# Altium schematic sheet Part25_Button_LED.SchDoc
size A4
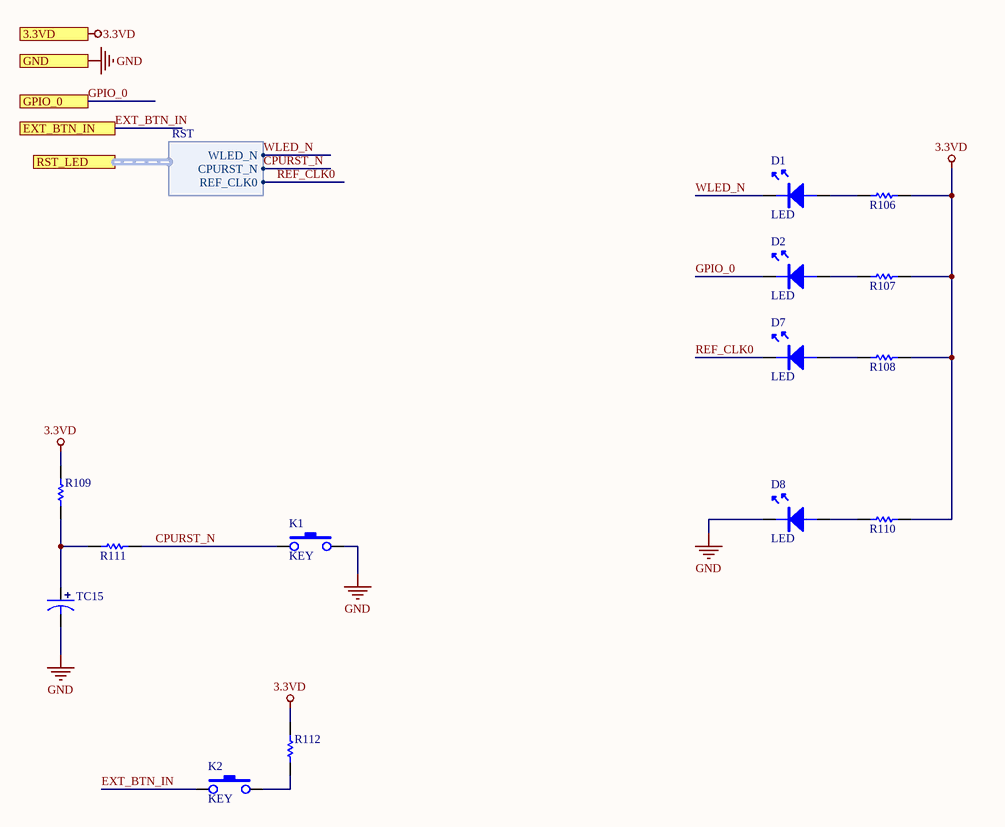
[diagram p0: Part25_Button_LED.SchDoc]

## Parts
D1  LED  [LED-0603B]
D2  LED  [LED-0603B]
D7  LED  [LED-0603B]
D8  LED  [LED-0603B]
K1  KEY  [SMD-6X6X4.3]
K2  KEY  [SMD-6X6X4.3]
R106  RES  [0402R]  (value not drawn)
R107  RES  [0402R]  (value not drawn)
R108  RES  [0402R]  (value not drawn)
R109  RES  [0402R]  (value not drawn)
R110  RES  [0402R]  (value not drawn)
R111  RES  [0402R]  (value not drawn)
R112  RES  [0402R]  (value not drawn)
TC15  4.7uF/6.3V  [TAJ-A/3216]  (value not drawn)

## Ports
3.3VD, EXT_BTN_IN, GND, GPIO_0, RST_LED (harness RST)

## Harnesses
RST: WLED_N, CPURST_N, REF_CLK0

## Nets
3.3VD: R106.2 R107.2 R108.2 R109.1 R110.2 R112.1 ; port 3.3VD
GND: D8.K K1.3 TC15.2 ; port GND
CPURST_N: K1.1 R111.2 ; port RST_LED.CPURST_N
EXT_BTN_IN: K2.1 ; port EXT_BTN_IN
GPIO_0: D2.K ; port GPIO_0
REF_CLK0: D7.K ; port RST_LED.REF_CLK0
WLED_N: D1.K ; port RST_LED.WLED_N
NetD1_A: D1.A R106.1
NetD2_A: D2.A R107.1
NetD7_A: D7.A R108.1
NetD8_A: D8.A R110.1
NetK2_3: K2.3 R112.2
NetR109_2: R109.2 R111.1 TC15.1

## Library data of the parts
TC15 = TCAP: 钽电容